# EAGLE design Cerradura electronica (EAGLE 9.5.1)
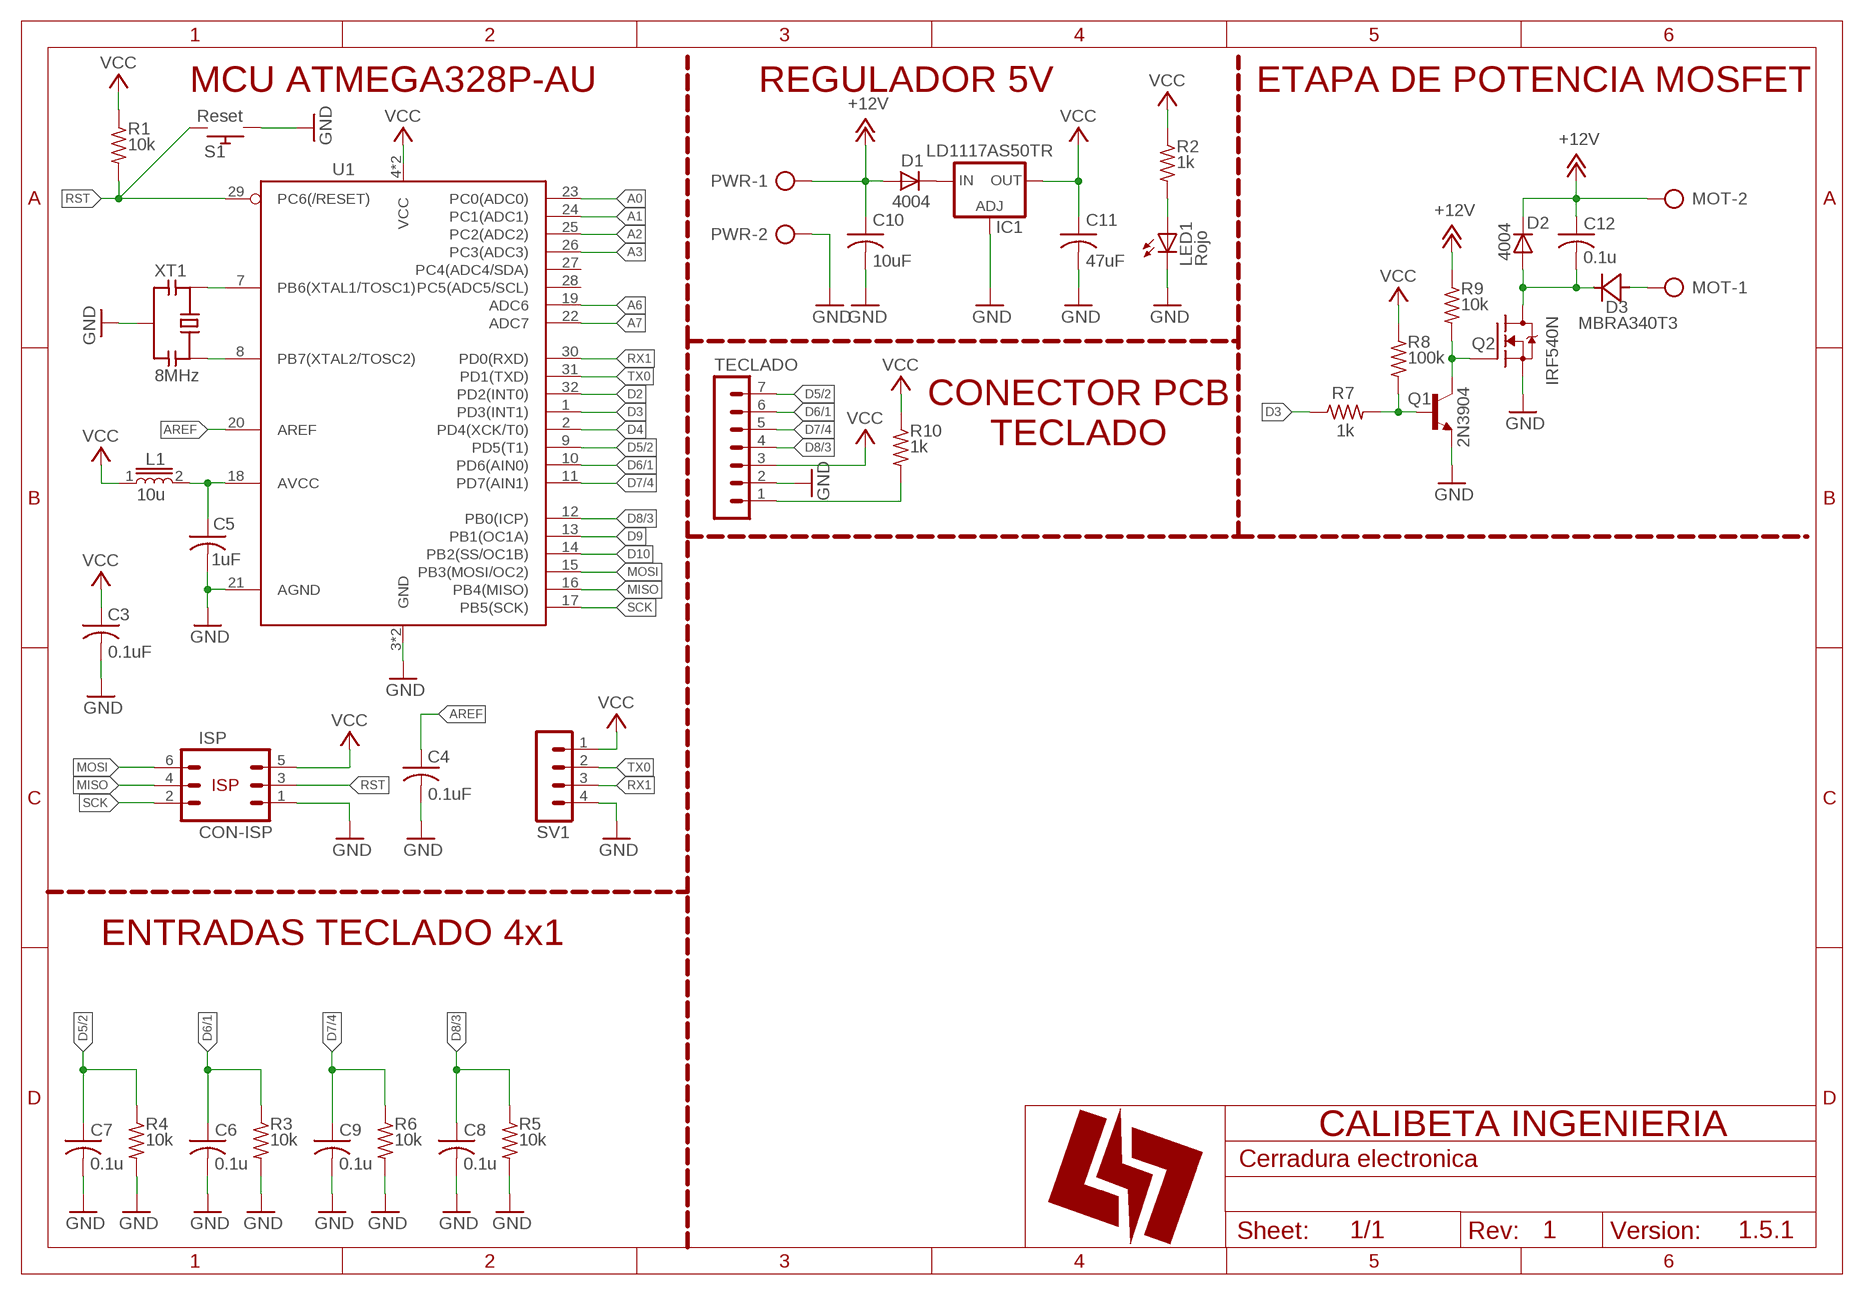
[diagram p0: schematic, sheet 1]

## Parts
C3  0.1uF  CAPC0805  [C0805]
C4  0.1uF  CAPC0805  [C0805]
C5  1uF  CAPC0805  [C0805]
C6  0.1u  CAPC0805  [C0805]
C7  0.1u  CAPC0805  [C0805]
C8  0.1u  CAPC0805  [C0805]
C9  0.1u  CAPC0805  [C0805]
C10  10uF  CAPC1206  [C1206]
C11  47uF  CAPC1206  [C1206]
C12  0.1u  CAPC0805  [C0805]
D1  4004  DIODO-DO-214AC  [DO-214AC]
D2  4004  DIODO-DO-214AC  [DO-214AC]
D3  MBRA340T3  [SMA]
IC1  LD1117AS50TR  [SOT-223]
ISP  CON-ISP  [HEADER-M2X3]
L1  10u  IND-FER-L0805  [L0805]
LED1  Rojo  LED-ROJO0805  [LED0805-ROJO]
MOT  AK500-2  [AK500-2]
PWR  AK500-2  [AK500-2]
Q1  2N3904  SS8050  [SOT-23_BEC]
Q2  IRF540N  [TO-263]
R1  10k  RESISTOR_R0805  [R0805]
R2  1k  RESISTOR_R0805  [R0805]
R3  10k  RESISTOR_R0805  [R0805]
R4  10k  RESISTOR_R0805  [R0805]
R5  10k  RESISTOR_R0805  [R0805]
R6  10k  RESISTOR_R0805  [R0805]
R7  1k  RESISTOR_R0805  [R0805]
R8  100k  RESISTOR_R0805  [R0805]
R9  10k  RESISTOR_R0805  [R0805]
R10  1k  RESISTOR_R0805  [R0805]
S1  Reset  PULSADOR-SMD-6035  [ST-SMD-6X3.5MM]
SV1  MA04-1  [MA04-1]
TECLADO  MA07-1  [MA07-1]
U1  ATMEGA328P-AU  [TQFP32]
U$1  A4_H-LOGO  [LOGO-10MM]
XT1  8MHz  CSTNE8M00G52-R0  [3-SMD]

## Nets
+12V: C10.1 C12.1 D1.A D2.K(C) MOT.2 PWR.1 R9.1
A0: U1.23(PC0(ADC0))
A1: U1.24(PC1(ADC1))
A2: U1.25(PC2(ADC2))
A3: U1.26(PC3(ADC3))
A6: U1.19(ADC6)
A7: U1.22(ADC7)
AREF: C4.1 U1.20(AREF)
AVCC: C5.1 L1.2 U1.18(AVCC)
D2: U1.32(PD2(INT0))
D3: R7.1 U1.1(PD3(INT1))
D4: U1.2(PD4(XCK/T0))
D5/2: C7.1 R4.1 TECLADO.7 U1.9(PD5(T1))
D6/1: C6.1 R3.1 TECLADO.6 U1.10(PD6(AIN0))
D7/4: C9.1 R6.1 TECLADO.5 U1.11(PD7(AIN1))
D8/3: C8.1 R5.1 TECLADO.4 U1.12(PB0(ICP))
D9: U1.13(PB1(OC1A))
D10: U1.14(PB2(SS/OC1B))
GND: C3.2 C4.2 C5.2 C6.2 C7.2 C8.2 C9.2 C10.2 C11.2 IC1.1(ADJ) ISP.1 LED1.C PWR.2 Q1.E Q2.3(S) R3.2 R4.2 R5.2 R6.2 S1.1 SV1.4 TECLADO.2 U1.3(GND) U1.5(GND) U1.21(AGND) XT1.2(GND)
MISO: ISP.4 U1.16(PB4(MISO))
MOSI: ISP.6 U1.15(PB3(MOSI/OC2))
MOT: D3.A MOT.1
N$1: LED1.A R2.2
N$2: Q1.B R7.2 R8.2
N$3: D1.K(C) IC1.3(IN)
N$4: Q1.C Q2.1(G) R9.2
N$5: U1.7(PB6(XTAL1/TOSC1)) XT1.1(X1)
N$6: U1.8(PB7(XTAL2/TOSC2)) XT1.3(X2)
N$11: R10.2 TECLADO.1
ON: C12.2 D2.A D3.C Q2.2(D)
RST: ISP.3 R1.2 S1.2 U1.29(PC6(/RESET))
RX1: SV1.3 U1.30(PD0(RXD))
SCK: ISP.2 U1.17(PB5(SCK))
TX0: SV1.2 U1.31(PD1(TXD))
VCC: C3.1 C11.1 IC1.4(OUT) ISP.5 L1.1 R1.1 R2.1 R8.1 R10.1 SV1.1 TECLADO.3 U1.4(VCC) U1.6(VCC)
Unconnected: U1.27(PC4(ADC4/SDA)) U1.28(PC5(ADC5/SCL))

## Notes on the sheet
- MCU ATMEGA328P-AU | REGULADOR 5V | ETAPA DE POTENCIA MOSFET
- CONECTOR PCB
  TECLADO
- ENTRADAS TECLADO 4x1
- 1 | 1.5.1

## Library data of the parts
C3-C12 = CaliBeta-RCL:CAP: Capacitor ceramico multicapa
D1 D2 = CaliBeta-Diodos:DIODO: Diodo rectificador de Silicio Vf:0.7V
D3 = diode:MBRA340T3: Surface Mount Schottky Power Rectifier Source: http://www.onsemi.com/pub_link/Collateral/MBRA340T3-D.PDF
IC1 = CaliBeta-IC power:LD1117A?*: Reguladores de voltaje positivo fijos y ajustables de baja caída 1 A Fuente: http://www.st.com/stonline/products/literature/ds/7194/ld1117axx.pdf
ISP = CaliBeta-Conectores:CON-ISP: conector ips 6 pines para programar microcontroladores Atmel
L1 = CaliBeta-RCL:IND-FER-: Inductor con nucleo de ferrita
LED1 = CaliBeta-Diodos:LED-ROJO: LED SMD Imax:20mA, color Rojo
MOT PWR = CaliBeta-Conectores:AK500-2: Conector terminal block 5.08 pitch
Q1 = CaliBeta-Transistores:SS8050: NPN de proposito general Vce=40V , Ic=1.5A - 0.3W
Q2 = CaliBeta-Transistores:IRF540N: Transistor MOSFET de canal N, 100V - 33A
R1-R10 = CaliBeta-RCL:RESISTOR_: RESISTOR, simbolo Americano
S1 = CaliBeta-Miselaneos:PULSADOR-
SV1 = con-lstb:MA04-1: PIN HEADER; OC_FARNELL: unknown; OC_NEWARK: unknown
TECLADO = con-lstb:MA07-1: PIN HEADER; OC_FARNELL: unknown; OC_NEWARK: unknown
U1 = CaliBeta-Microcontroladores:ATMEGA328P: Microcontrolador AVR de 8 bits 32KB memoria Flash
U$1 = CaliBeta-Estilos:A4_H-LOGO
XT1 = CaliBeta-Cristales:CSTNE8M00G52-R0: Crystal ceramico resonador fabricado con capacitor, 8MHz - 10pF, ±0.5% - 40 Ohm Datasheet <https://www.murata.com/~/media/webrenewal/support/library/catalog/products/timingdevice/ceralock/p17e.ashx>

## Net classes
0 default: width 0.203 mm
1 vcc: width 0.254 mm

## Board
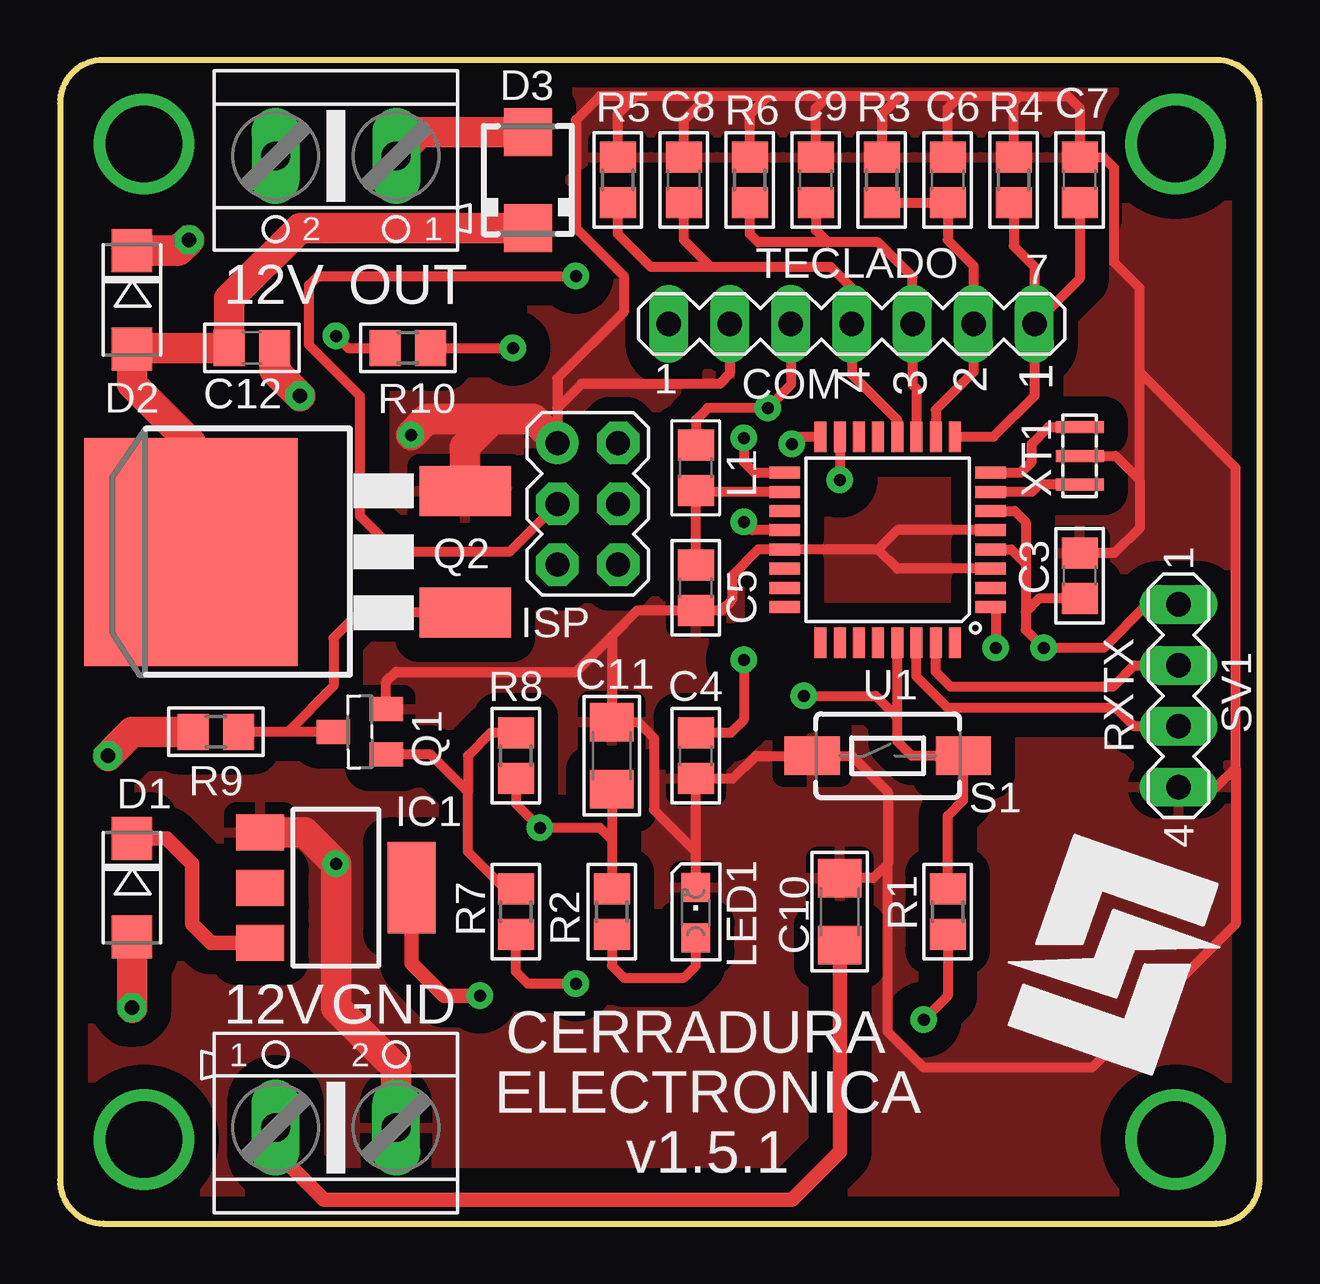
[diagram p1: board, top side]
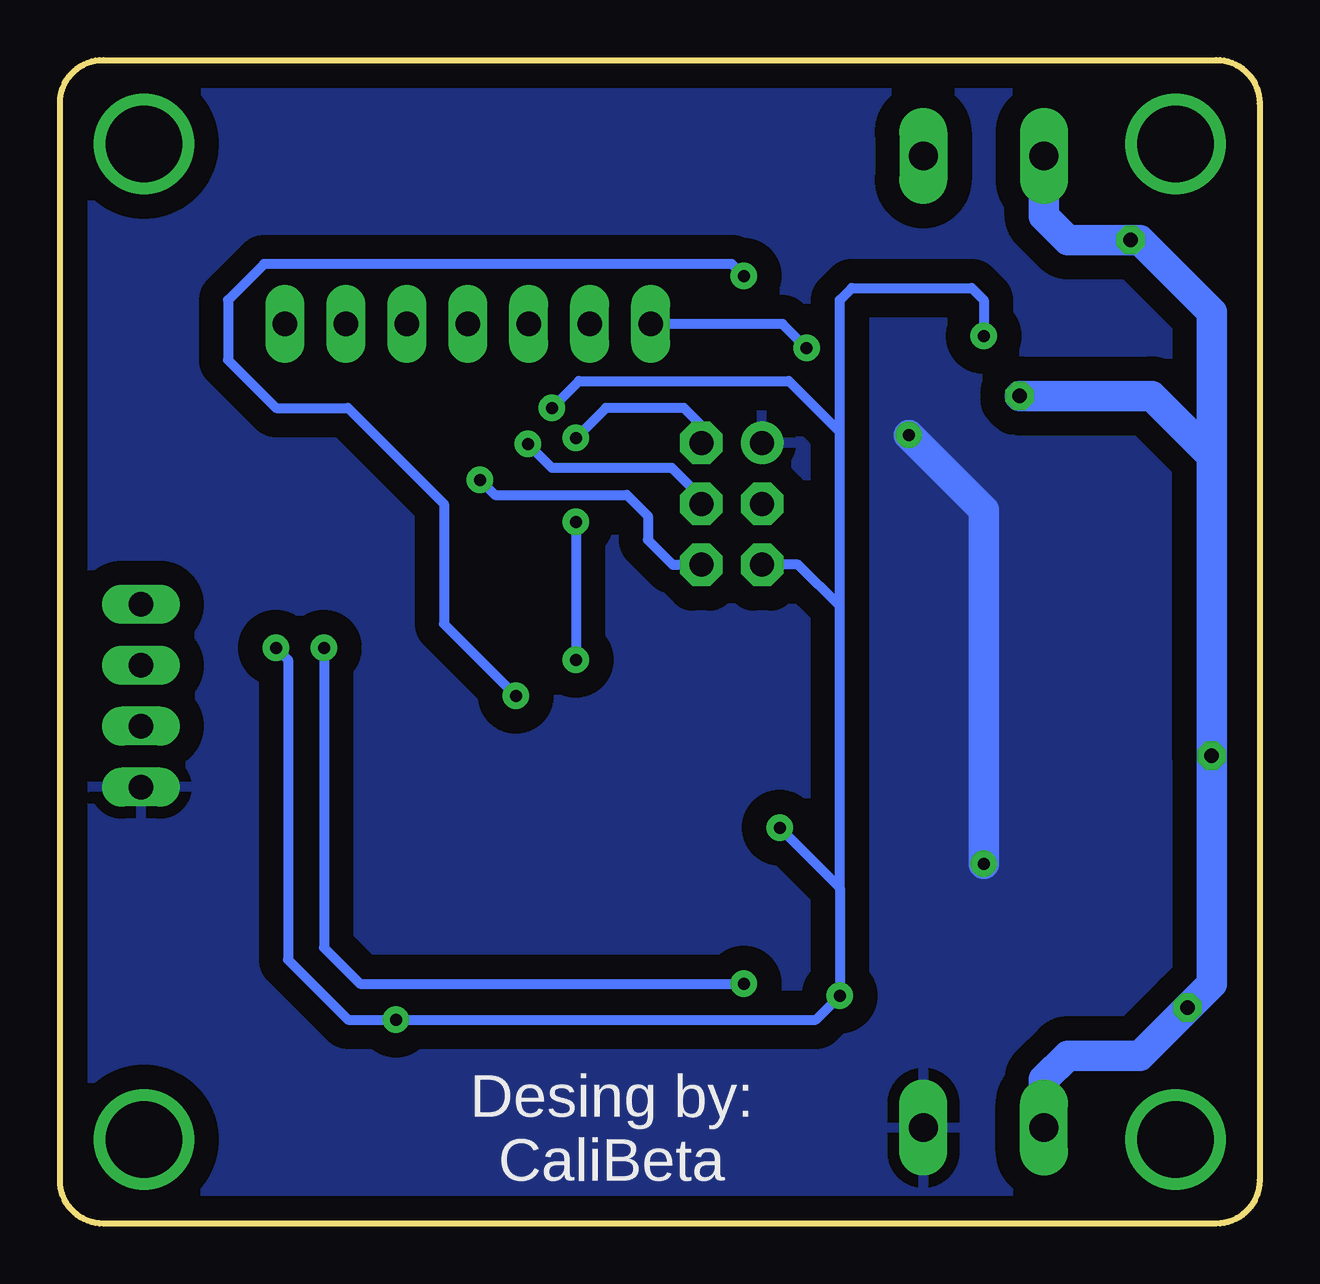
[diagram p2: board, bottom side, seen from below]

Size 50 x 48.5 mm. Coordinates in mm from the lower left corner, seen from the top.
Outline: 48.2,48.5 1.8,48.5 arc90 0,46.7 0,1.8 arc90 1.8,0 48.2,0 arc90 50,1.8 50,46.7 arc90 48.2,48.5
Copper layers (1*16): Top 0.035mm / dielectric 1.5mm / Bottom 0.035mm
Design rules "Fabricacion_China": minimum track width 0.25mm, minimum drill 0.5mm, track to track 0.24mm, track to pad 0.23mm, pad to pad 0.2mm, via to via 0.25mm, smd to smd 0.2mm, copper to edge 0.5mm, drill to drill 0.3mm, minimum pad ring 0.3mm, minimum via ring 0.3mm, stop-mask expansion 3mil, vias tented up to drill 0.5mm, thermal gap 20mil

### Footprints (pad centres in the part's own frame; a part is rotated, then mirrored left to right if it is on the bottom)
C0805 = smd 1.3 x 1.5: 1 -0.95,0; 2 0.95,0
C1206 = smd 1.6 x 1.8: 1 -1.4,0; 2 1.4,0
DO-214AC = smd 1.8 x 1.7: A 2.05,0; K -2.05,0
SMA = smd 2 x 2: A 2,0; C -2,0
SOT-223 = smd 1.5 x 2: 1 -2.3,-3.15; 2 0,-3.15; 3 2.3,-3.15 | smd 3.8 x 2: 4 0,3.15
HEADER-M2X3 = drill 1 pad 1.778: 1 -2.54,-1.27 | drill 1 pad 1.778 octagon: 2 -2.54,1.27; 3 0,-1.27; 4 0,1.27; 5 2.54,-1.27; 6 2.54,1.27
L0805 = smd 1.3 x 1.5: 1 -0.95,0; 2 0.95,0
LED0805-ROJO = smd 1.2 x 1.2: A -1.09,0; C 1.01,0
AK500-2 = drill 1.2 pad 2 long: 1 -2.515,0; 2 2.515,0
SOT-23_BEC = smd 1 x 1.4: B -0.95,-1.1; C 0,1.1; E 0.95,-1.1
TO-263 = smd 2.083 x 3.81: 1 -2.54,-8.89; 3 2.54,-8.89 | smd 9.5 x 8.89: 2 0,2.54
R0805 = smd 1.3 x 1.5: 1 -0.95,0; 2 0.95,0
ST-SMD-6X3.5MM = smd 2.3 x 1.6: 1 -3.15,0; 2 3.15,0
MA04-1 = drill 1.016 long: 1 -3.81,0; 2 -1.27,0; 3 1.27,0; 4 3.81,0
MA07-1 = drill 1.016 long: 1 -7.62,0; 2 -5.08,0; 3 -2.54,0; 4 0,0; 5 2.54,0; 6 5.08,0; 7 7.62,0
TQFP32 = smd 1.27 x 0.5: 1 -4.293,2.8; 2 -4.293,2; 3 -4.293,1.2; 4 -4.293,0.4; 5 -4.293,-0.4; 6 -4.293,-1.2; 7 -4.293,-2; 8 -4.293,-2.8; 17 4.293,-2.8; 18 4.293,-2; 19 4.293,-1.2; 20 4.293,-0.4; 21 4.293,0.4; 22 4.293,1.2; 23 4.293,2; 24 4.293,2.8 | smd 0.5 x 1.27: 9 -2.8,-4.293; 10 -2,-4.293; 11 -1.2,-4.293; 12 -0.4,-4.293; 13 0.4,-4.293; 14 1.2,-4.293; 15 2,-4.293; 16 2.8,-4.293; 25 2.8,4.293; 26 2,4.293; 27 1.2,4.293; 28 0.4,4.293; 29 -0.4,4.293; 30 -1.2,4.293; 31 -2,4.293; 32 -2.8,4.293
3-SMD = smd 0.5 x 2: 1 1.2,0; 2 0,0; 3 -1.2,0

### Placement (x,y rotation side)
C3  42.5,27 90 top
C4  26.5,19.5 270 top
C5  26.5,26.5 270 top
C6  37,43.5 90 top
C7  42.5,43.5 90 top
C8  26,43.5 90 top
C9  31.5,43.5 90 top
C10  32.5,13 90 top
C11  23,19.5 90 top
C12  8,36.5 180 top
D1  3,14 270 top
D2  3,38.5 270 top
D3  19.5,43.5 90 top
IC1  11.5,14 270 top
ISP  22,30 270 top
L1  26.5,31.5 270 top
LED1  26.5,13 90 top
MOT  11.5,44.5 180 top
PWR  11.5,4 0 top
Q1  12.5,20.5 90 top
Q2  8,28 90 top
R1  37,13 90 top
R2  23,13 270 top
R3  34.25,43.5 90 top
R4  39.75,43.5 90 top
R5  23.25,43.5 90 top
R6  28.75,43.5 90 top
R7  19,13 90 top
R8  19,19.5 90 top
R9  6.5,20.5 0 top
R10  14.5,36.5 0 top
S1  34.5,19.5 0 top
SV1  46.62,22 270 top
TECLADO  33,37.5 0 top
U1  34.5,28.5 180 top
U$1  44,11.25 270 top
XT1  42.5,32 270 top

### Tracks (layer width: path | path; a pad name or v marks a point on that pad's centre or on a via)
1  (via drill 3.2 pad 3.81)
  other vias: 3.5,45
2  (via drill 3.2 pad 3.81)
  other vias: 3.5,3.5
3  (via drill 3.2 pad 3.81)
  other vias: 46.5,45
4  (via drill 3.2 pad 3.81)
  other vias: 46.5,3.5
+12V  (via drill 0.6)
  Top 0.61: PWR.1 8.98,3.02 11,1 30.5,1 32.5,3 C10.1
  Top 1.27: v3,9 D1.A | R9.1 3,20.5 v2,19.5 | C12.1 8.95,35.55 v10,34.5 | D2.K 4.92,40.55 v5.38,41
  Bottom 1.27: 2,32 v2,19.5 2,10 v3,9 5,7 8,7 8.98,6.01 PWR.1 | 2,32 2,38 5,41 v5.38,41 8,41 8.98,41.98 MOT.2 | v10,34.5 4.5,34.5 2,32
AREF  (via drill 0.5)
  Top 0.406: U1.20 28.85,28.9 v28.5,29.25 | C4.1 27.95,20.45 28.5,21 v28.5,23.5
  Bottom 0.406: v28.5,29.25 v28.5,23.5
AVCC
  Top 0.406: U1.18 26.55,30.5 L1.2 C5.1
D3  (via drill 0.5)
  Top 0.406: U1.1 39,25.49 v39,24 | v21.5,10 19.5,10 19,10.5 R7.1
  Bottom 0.406: v39,24 39,11.5 37.5,10 v21.5,10
D5/2
  Top 0.406: TECLADO.7 40.62,34.5 38.91,32.79 U1.9 | C7.1 42.5,39.38 TECLADO.7 | R4.1 39.75,40.75 40.62,39.88 TECLADO.7
D6/1
  Top 0.406: U1.10 36.5,33.92 38.08,35.5 TECLADO.6 38.08,39.92 37,41 C6.1 R3.1
D7/4
  Top 0.406: U1.11 35.7,34.8 35.54,34.96 TECLADO.5 35.54,39.46 34.1,40.9 32,40.9 | R6.1 28.75,41.25 29.1,40.9 32,40.9 | 32,40.9 31.5,41.4 C9.1
D8/3
  Top 0.406: U1.12 34.9,33.49 33,35.39 TECLADO.4 33,39 32.12,39.88 27.12,39.88 | C8.1 26,41 27.12,39.88 | 27.12,39.88 24.62,39.88 23.25,41.25 R5.1
GND  (via drill 0.5)
  Top 0.406: 40,47 37.5,47 | 40,47 42,47 42.5,46.5 C7.2 43.5,44.45 43.95,44 43.95,40.05 45,39 45,35.5 | R4.2 39.75,46.75 40,47 | C6.2 37,46.5 37.5,47 | U1.5 34.9,28.9 34.1,28.1 | 34.1,28.1 U1.21 29.1,28.1 28,27 28,26 27.55,25.55 C5.2 24.05,25.55 23,24.5 | U1.3 34.9,27.3 34.1,28.1 | XT1.2 44,32 45,31 | 45,31 45,29 43.95,27.95 C3.2 | 45,31 45,35.5 | 37.5,47 35,47 | R3.2 34.25,46.25 35,47 | 35,47 32,47 | 32,47 29.5,47 | 29.5,47 27,47 | 27,47 24,47 | R5.2 23.25,46.25 24,47 | C8.2 26,46 27,47 | R6.2 28.75,46.25 29.5,47 | C9.2 31.5,46.5 32,47 | 23,24.5 C11.2 24.1,20.9 24.75,20.25 24.75,17.25 26.5,15.5 | LED1.C 26.5,15.5 | 26.5,15.5 C4.2 28.05,18.55 29,19.5 S1.1 33,19.5 34.5,18 34.5,15 | 34.5,15 33.9,14.4 C10.2 | TECLADO.2 27.92,35.42 27.5,35 21.73,35 20.73,34 | Q1.E 13.6,22.6 14,23 21.5,23 23,24.5 | SV1.4 48.19,18.19 49,19 | 49,19 49,31.5 45,35.5 | 24,47 22.5,47 21.5,46 21.5,41.5 23.5,39.5 23.5,38 20.73,35.23 20.73,34 | 49,19 49,12.5 43,6.5 36,6.5 34.5,8 34.5,15 | 20.73,34 ISP.1
  Top 1.27: IC1.1 10.2,16.3 v11.5,15 11.5,9 14.02,6.49 PWR.2 | ISP.1 19.73,33.54 18.04,33.54 | Q2.3 16.89,32.39 18.04,33.54 | v14.62,32.88 15.29,33.54 18.04,33.54
  Bottom 1.27: v11.5,15 11.5,29.75 v14.62,32.88
  pour Bottom (isolate 1.016): -1,49.5 -1,-1 51,-1 51,49.5
  pour Top (isolate 1.016): -0.5,49 -0.5,-0.5 50.5,-0.5 50.5,49
MISO  (via drill 0.5)
  Top 0.406: v30.5,32.5 30.79,32.79 U1.16
  Bottom 0.406: v30.5,32.5 29.5,31.5 24.5,31.5 23.27,30.27 ISP.4
MOSI  (via drill 0.5)
  Top 0.406: U1.15 v32.5,31
  Bottom 0.406: v32.5,31 31.88,30.38 26.38,30.38 25.5,29.5 25.5,28.5 24.46,27.46 ISP.6
MOT
  Top 1.27: D3.A 15.02,45.5 MOT.1
N$1
  Top 0.406: R2.2 23,10.75 23.5,10.25 26,10.25 26.5,10.75 LED1.A
N$2
  Top 0.406: R7.2 18.55,13.95 17,15.5 17,18 | 17,18 15.45,19.55 Q1.B | R8.2 17.95,20.45 17,19.5 17,18
N$3
  Top 0.61: IC1.3 6.3,11.7 5.5,12.5 5.5,15 4.45,16.05 D1.K
N$4
  Top 0.406: Q1.C 9.5,20.5 | 9.5,20.5 R9.2 | 9.5,20.5 11.4,22.4 11.4,24.4 12.46,25.46 Q2.1
N$5
  Top 0.406: XT1.1 40.8,30.8 40.5,30.5 U1.7
N$6
  Top 0.406: U1.8 40.05,31.3 40.5,31.75 40.5,32.5 41.2,33.2 XT1.3
N$11  (via drill 0.5)
  Top 0.406: R10.2 v18.88,36.5
  Bottom 0.406: TECLADO.1 19.88,37.5 v18.88,36.5
ON
  Top 1.27: Q2.2 5.46,32.54 3,35 D2.A 3.05,36.5 C12.2 7.05,38.55 10,41.5 D3.C
RST  (via drill 0.5)
  Top 0.406: 34.9,21.1 U1.29 | 34.9,21.1 34,22 v31,22 | R1.2 37,17 37.65,17.65 S1.2 35.5,19.5 34.9,20.1 34.9,21.1 | ISP.3 18.73,28 14,28 12.5,29.5 12.5,34.5 10.38,36.62 10.38,39.12 10.75,39.5 v21.5,39.5
  Bottom 0.406: v21.5,39.5 22,40 41.5,40 43,38.5 43,36 41,34 38,34 34,30 34,25 v31,22
RX1
  Top 0.406: SV1.3 44.77,20.73 44,21.5 37,21.5 35.7,22.8 U1.30
SCK  (via drill 0.5)
  Top 0.406: v28.5,32.75 28.5,31.75 28.95,31.3 U1.17
  Bottom 0.406: ISP.2 23.27,33.27 24,34 27.25,34 v28.5,32.75
TX0
  Top 0.406: SV1.2 44.77,23.27 43.88,22.38 37.12,22.38 36.5,23 U1.31
VCC  (via drill 0.5)
  Top 0.406: SV1.1 45.31,25.81 43.5,24 v41,24 40.25,24.75 40.25,25.5 | U1.6 39.8,29.7 40.25,29.25 40.25,27.5 | 40.25,27.5 40.25,25.5 | U1.4 39.65,28.1 40.25,27.5 | C11.1 23,16 | 23,16 R2.1 | R8.1 19,17.5 v20,16.5 22.5,16.5 23,16 | TECLADO.3 30.46,34.96 v29.5,34 27,34 26.5,33.5 L1.1 | v11.5,37 12,36.5 R10.1 | R1.1 37,9.5 v36,8.5 | C3.1 40.8,26.05 40.25,25.5
  Top 0.61: v17.5,9.5 16,9.5 14.65,10.85 IC1.4
  Bottom 0.406: v41,24 40.5,23.5 40.5,11 38,8.5 v36,8.5 18.5,8.5 v17.5,9.5 17.5,14 | v20,16.5 17.5,14 | 17.5,14 17.5,25.73 | ISP.5 19.23,27.46 17.5,25.73 | v11.5,37 11.5,38.5 12,39 17,39 17.5,38.5 17.5,33 | v29.5,34 28.38,35.12 19.62,35.12 17.5,33 | 17.5,25.73 17.5,33

### Text on the board
tPlace: 12V | OUT | COM | 4 | 3 | 2 | 1 | TX | RX | 12V | GND | CERRADURA | ELECTRONICA | v1.5.1
bPlace: Desing by: / CaliBeta